# Altium schematic sheet TweakWave-Mainboard.SchDoc
size A; SheetNumber: 1; SheetTotal: 4
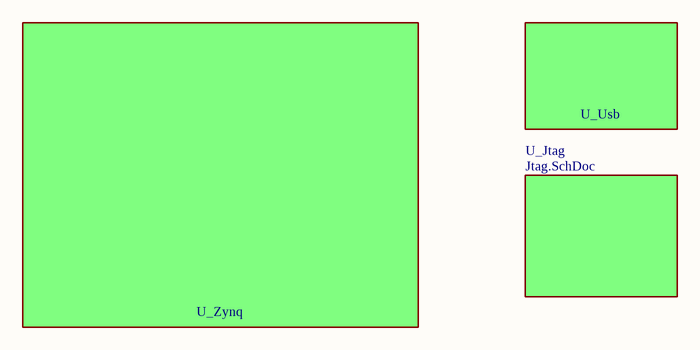
[diagram p0: TweakWave-Mainboard.SchDoc]

## Sub-sheets
U_Jtag = Jtag.SchDoc: no entries
U_Usb = Usb.SchDoc: no entries
U_Zynq = Zynq.SchDoc: no entries